# EAGLE schematic esp-switchnode-02 (EAGLE 7.3.0)
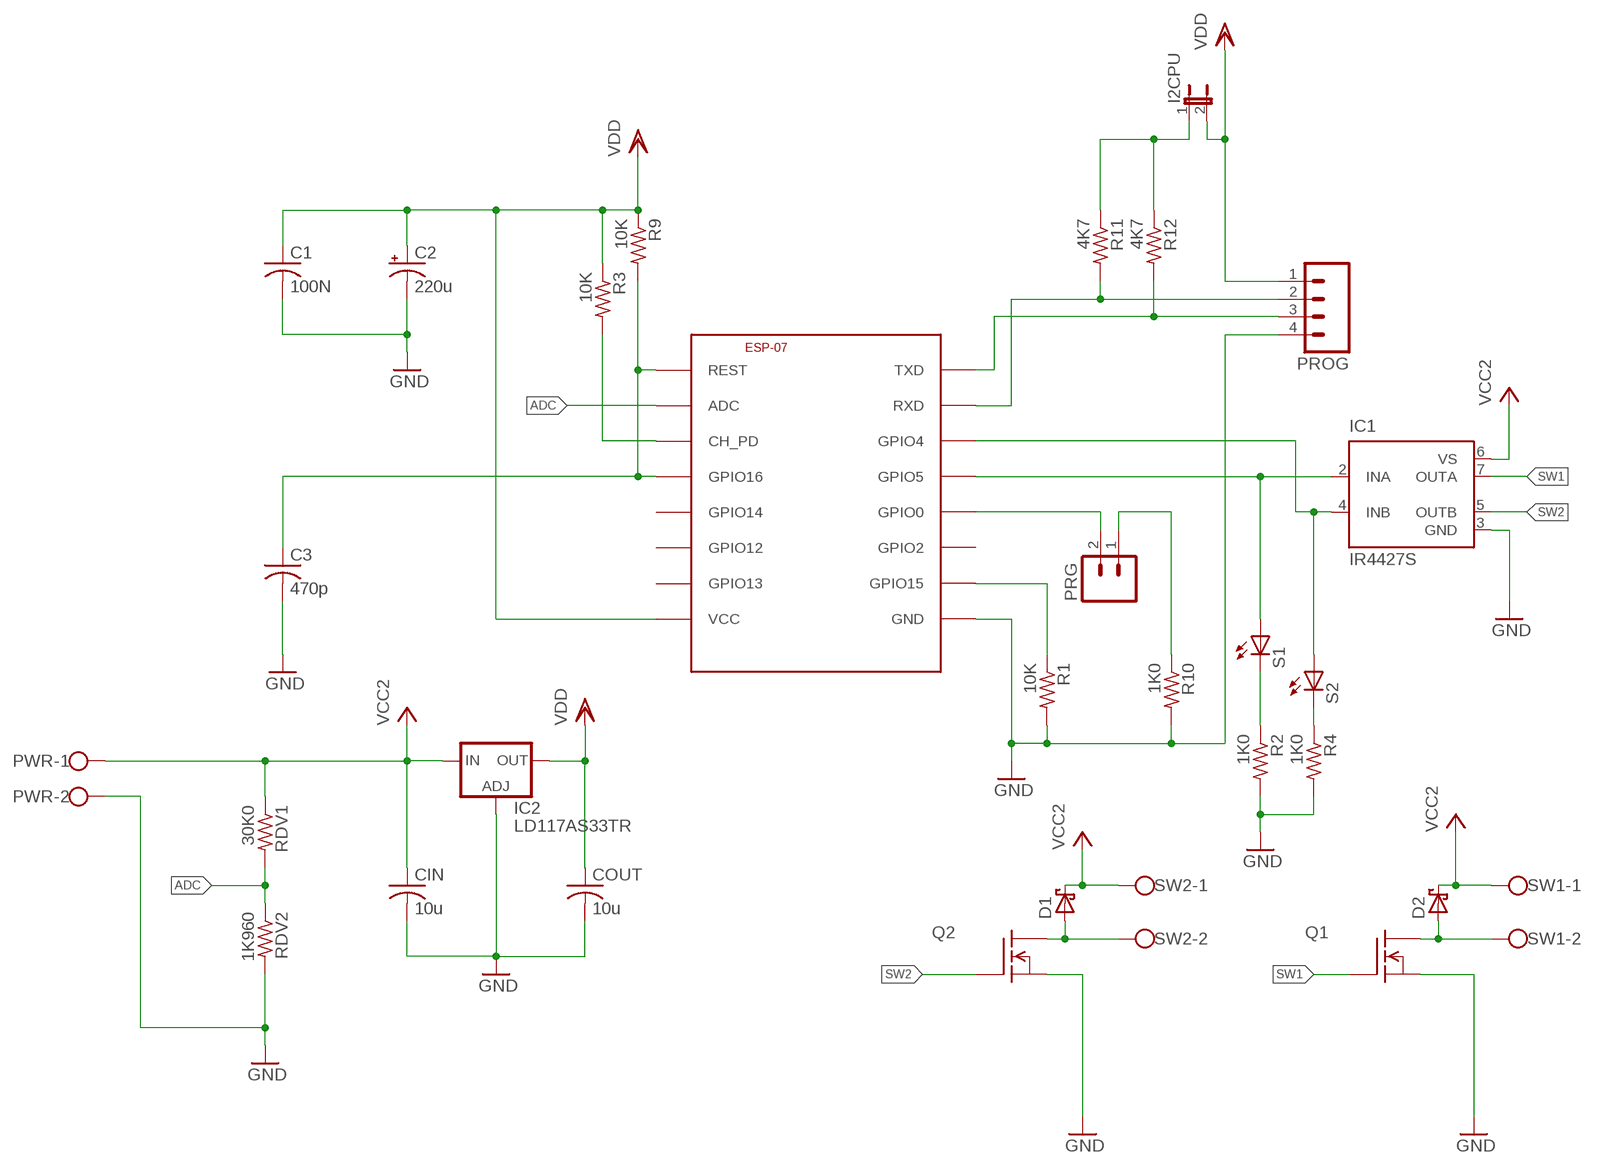
[diagram p0: schematic, sheet 1]

## Parts
C1  100N  C-USC0603  [C0603]
C2  220u  CPOL-USSMCD  [SMC_D]
C3  470p  C-USC0603  [C0603]
CIN  10u  C-USC1210  [C1210]
COUT  10u  C-USC1206  [C1206]
D1  SCHOTTKY-SOD123  [SOD123]
D2  SCHOTTKY-SOD123  [SOD123]
ESP-07  ESP8266-07  [ESP-07]
I2CPU  JUMPER-2SMD-NO  [SJ_2S-NO]
IC1  IR4427S  [SO08]
IC2  LD117AS33TR  [SOT223]
PRG  M02LOCK  [1X02_LOCK]
PROG  M04LOCK  [1X04_LOCK]
PWR  W237-102  [W237-102]
Q1  NFET-TO252  [TO252]
Q2  NFET-TO252  [TO252]
R1  10K  R-US_R0603  [R0603]
R2  1K0  R-US_R0603  [R0603]
R3  10K  R-US_R0603  [R0603]
R4  1K0  R-US_R0603  [R0603]
R9  10K  R-US_R0603  [R0603]
R10  1K0  R-US_R0603  [R0603]
R11  4K7  R-US_R0603  [R0603]
R12  4K7  R-US_R0603  [R0603]
RDV1  30K0  R-US_R0603  [R0603]
RDV2  1K960  R-US_R0603  [R0603]
S1  LEDCHIPLED_0805  [CHIPLED_0805]
S2  LEDCHIPLED_0805  [CHIPLED_0805]
SW1  W237-102  [W237-102]
SW2  W237-102  [W237-102]

## Nets
ADC: ESP-07.ADC RDV1.2 RDV2.1
ESPRX: ESP-07.RXD PROG.2 R11.2
ESPTX: ESP-07.TXD PROG.3 R12.2
GND: C1.2 C2.- C3.2 CIN.2 COUT.2 ESP-07.GND IC1.3(GND) IC2.1(ADJ) PROG.4 PWR.2 Q1.2(S) Q2.2(S) R1.2 R2.2 R4.2 R10.2 RDV2.2
GPIO0: ESP-07.GPIO0 PRG.2
N$1: D1.A Q2.3(D) SW2.2
N$2: D2.A Q1.3(D) SW1.2
N$3: ESP-07.GPIO4 IC1.4(INB) S2.A
N$4: R2.1 S1.C
N$6: ESP-07.CH_PD R3.2
N$8: I2CPU.1 R11.1 R12.1
N$13: ESP-07.GPIO15 R1.1
PRG: PRG.1 R10.1
REST: C3.1 ESP-07.GPIO16 ESP-07.REST R9.2
S2: R4.1 S2.C
SW1: IC1.7(OUTA) Q1.1(G)
SW2: IC1.5(OUTB) Q2.1(G)
SW2IN: ESP-07.GPIO5 IC1.2(INA) S1.A
VCC: CIN.1 D1.K D2.K IC1.6(VS) IC2.3(IN) PWR.1 RDV1.1 SW1.1 SW2.1 ; supply symbol labelled VCC2
VDD: C1.1 C2.+ COUT.1 ESP-07.VCC I2CPU.2 IC2.4(OUT) PROG.1 R3.1 R9.1
Unconnected: ESP-07.GPIO2 ESP-07.GPIO12 ESP-07.GPIO13 ESP-07.GPIO14

## Library data of the parts
C1 C3 CIN COUT = rcl:C-US: CAPACITOR, American symbol
C2 = rcl:CPOL-US: POLARIZED CAPACITOR, American symbol
D1 D2 = diode-special-packages:SCHOTTKY
ESP-07 = lio:ESP8266
I2CPU = SparkFun:JUMPER-2: Jumper Basic 0.1" spaced jumper. Use with breakaway headers.
IC1 = ir:IR4427: DUAL LOW SIDE DRIVER Source: ID4426.pdf; MF: INTERNATIONAL RECTIFIER(IR); MPN: IR4427STRPBF; OC_FARNELL: 8639094; OC_NEWARK: 63J7933
IC2 = v-reg:LD117A?*: Low drop fixed and adjustable positive voltage regulators 1 A Source: http://www.st.com/stonline/products/literature/ds/7194/ld1117axx.pdf
PRG = SparkFun:M02: Header 2 Standard 2-pin 0.1" header. Use with straight break away headers (SKU : PRT-00116), right angle break away headers (PRT-00553), swiss pins (PRT-00743), machine pins (PRT-00117), and female headers (PRT-00115). Molex polarized connector foot print use with SKU : PRT-08233 with associated crimp pins and housings.
PROG = SparkFun:M04: Header 4 Standard 4-pin 0.1" header. Use with straight break away headers (SKU : PRT-00116), right angle break away headers (PRT-00553), swiss pins (PRT-00743), machine pins (PRT-00117), and female headers (PRT-00115). Molex polarized connector foot print use with SKU : PRT-08231 with associated crimp pins and housings. 1MM SMD Version SKU: PRT-10208
PWR SW1 SW2 = con-wago-500:W237-102: WAGO SCREW CLAMP; MPN: 237-102; OC_FARNELL: unknown; OC_NEWARK: 70K9898
Q1 Q2 = transistor-generic:NFET
R1-R4 R9-R12 RDV1 RDV2 = rcl:R-US_: RESISTOR, American symbol
S1 S2 = led:LED: LED OSRAM: - CHIPLED LG R971, LG N971, LY N971, LG Q971, LY Q971, LO R971, LY R971 LH N974, LH R974 LS Q976, LO Q976, LY Q976 LO Q996 - Hyper CHIPLED LW Q18S LB Q993, LB Q99A, LB R99A - SideLED LS A670, LO A670, LY A670, LG A670, LP A670 LB A673, LV A673, LT A673, LW A673 LH A674 LY A675 LS A676, LA A676, LO A676, LY A676, LW A676 LS A679, LY A679, LG A679 - Hyper Micro SIDELED® LS Y876, LA Y876, LO Y876, LY Y876 LT Y87S - SmartLED LW L88C, LW L88S LB L89C, LB L89S, LG L890 LS L89K, LO L89K, LY L89K LS L896, LA L896, LO L896, LY L896 - TOPLED LS T670, LO T670, LY T670, LG T670, LP T670 LSG T670, LSP T670, LSY T670, LOP T670, LYG T670 LG T671, LOG T671, LSG T671 LB T673, LV T673, LT T673, LW T673 LH T674 LS T676, LA T676, LO T676, LY T676, LB T676, LH T676, LSB T676, LW T676 LB T67C, LV T67C, LT T67C, LS T67K, LO T67K, LY T67K, LW E67C LS E67B, LA E67B, LO E67B, LY E67B, LB E67C, LV E67C, LT E67C LW T67C LS T679, LY T679, LG T679 LS T770, LO T770, LY T770, LG T770, LP T770 LB T773, LV T773, LT T773, LW T773 LH T774 LS E675, LA E675, LY E675, LS T675 LS T776, LA T776, LO T776, LY T776, LB T776 LHGB T686 LT T68C, LB T68C - Hyper Mini TOPLED® LB M676 - Mini TOPLED Santana® LG M470 LS M47K, LO M47K, LY M47K Source: http://www.osram.convergy.de LUXEON: - LUMILED® LXK2-PW12-R00, LXK2-PW12-S00, LXK2-PW14-U00, LXK2-PW14-V00 LXK2-PM12-R00, LXK2-PM12-S00, LXK2-PM14-U00 LXK2-PE12-Q00, LXK2-PE12-R00, LXK2-PE12-S00, LXK2-PE14-T00, LXK2-PE14-U00 LXK2-PB12-K00, LXK2-PB12-L00, LXK2-PB12-M00, LXK2-PB14-N00, LXK2-PB14-P00, LXK2-PB14-Q00 LXK2-PR12-L00, LXK2-PR12-M00, LXK2-PR14-Q00, LXK2-PR14-R00 LXK2-PD12-Q00, LXK2-PD12-R00, LXK2-PD12-S00 LXK2-PH12-R00, LXK2-PH12-S00 LXK2-PL12-P00, LXK2-PL12-Q00, LXK2-PL12-R00 Source: www.luxeon.com KINGBRIGHT: KA-3528ASYC Source: www.kingbright.com